# EAGLE schematic FlipDot (EAGLE 7.5.0)
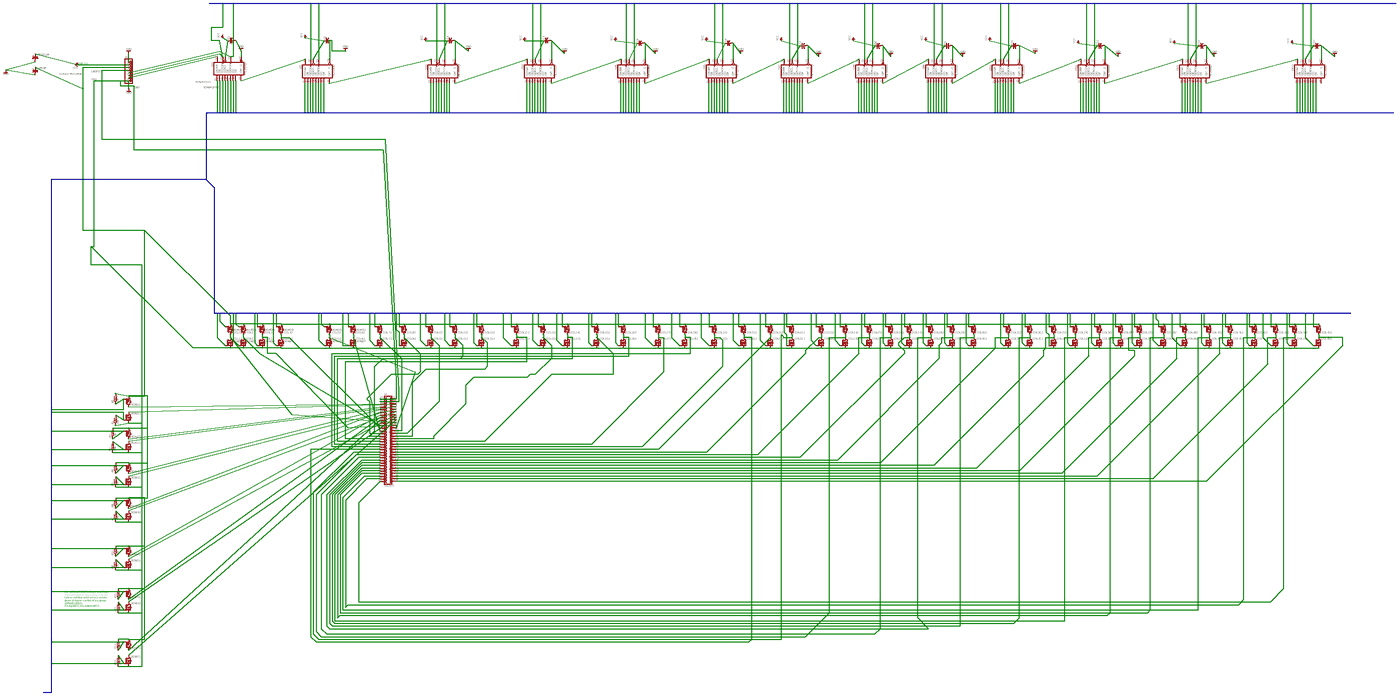
[diagram p0: schematic, sheet 1, overview]
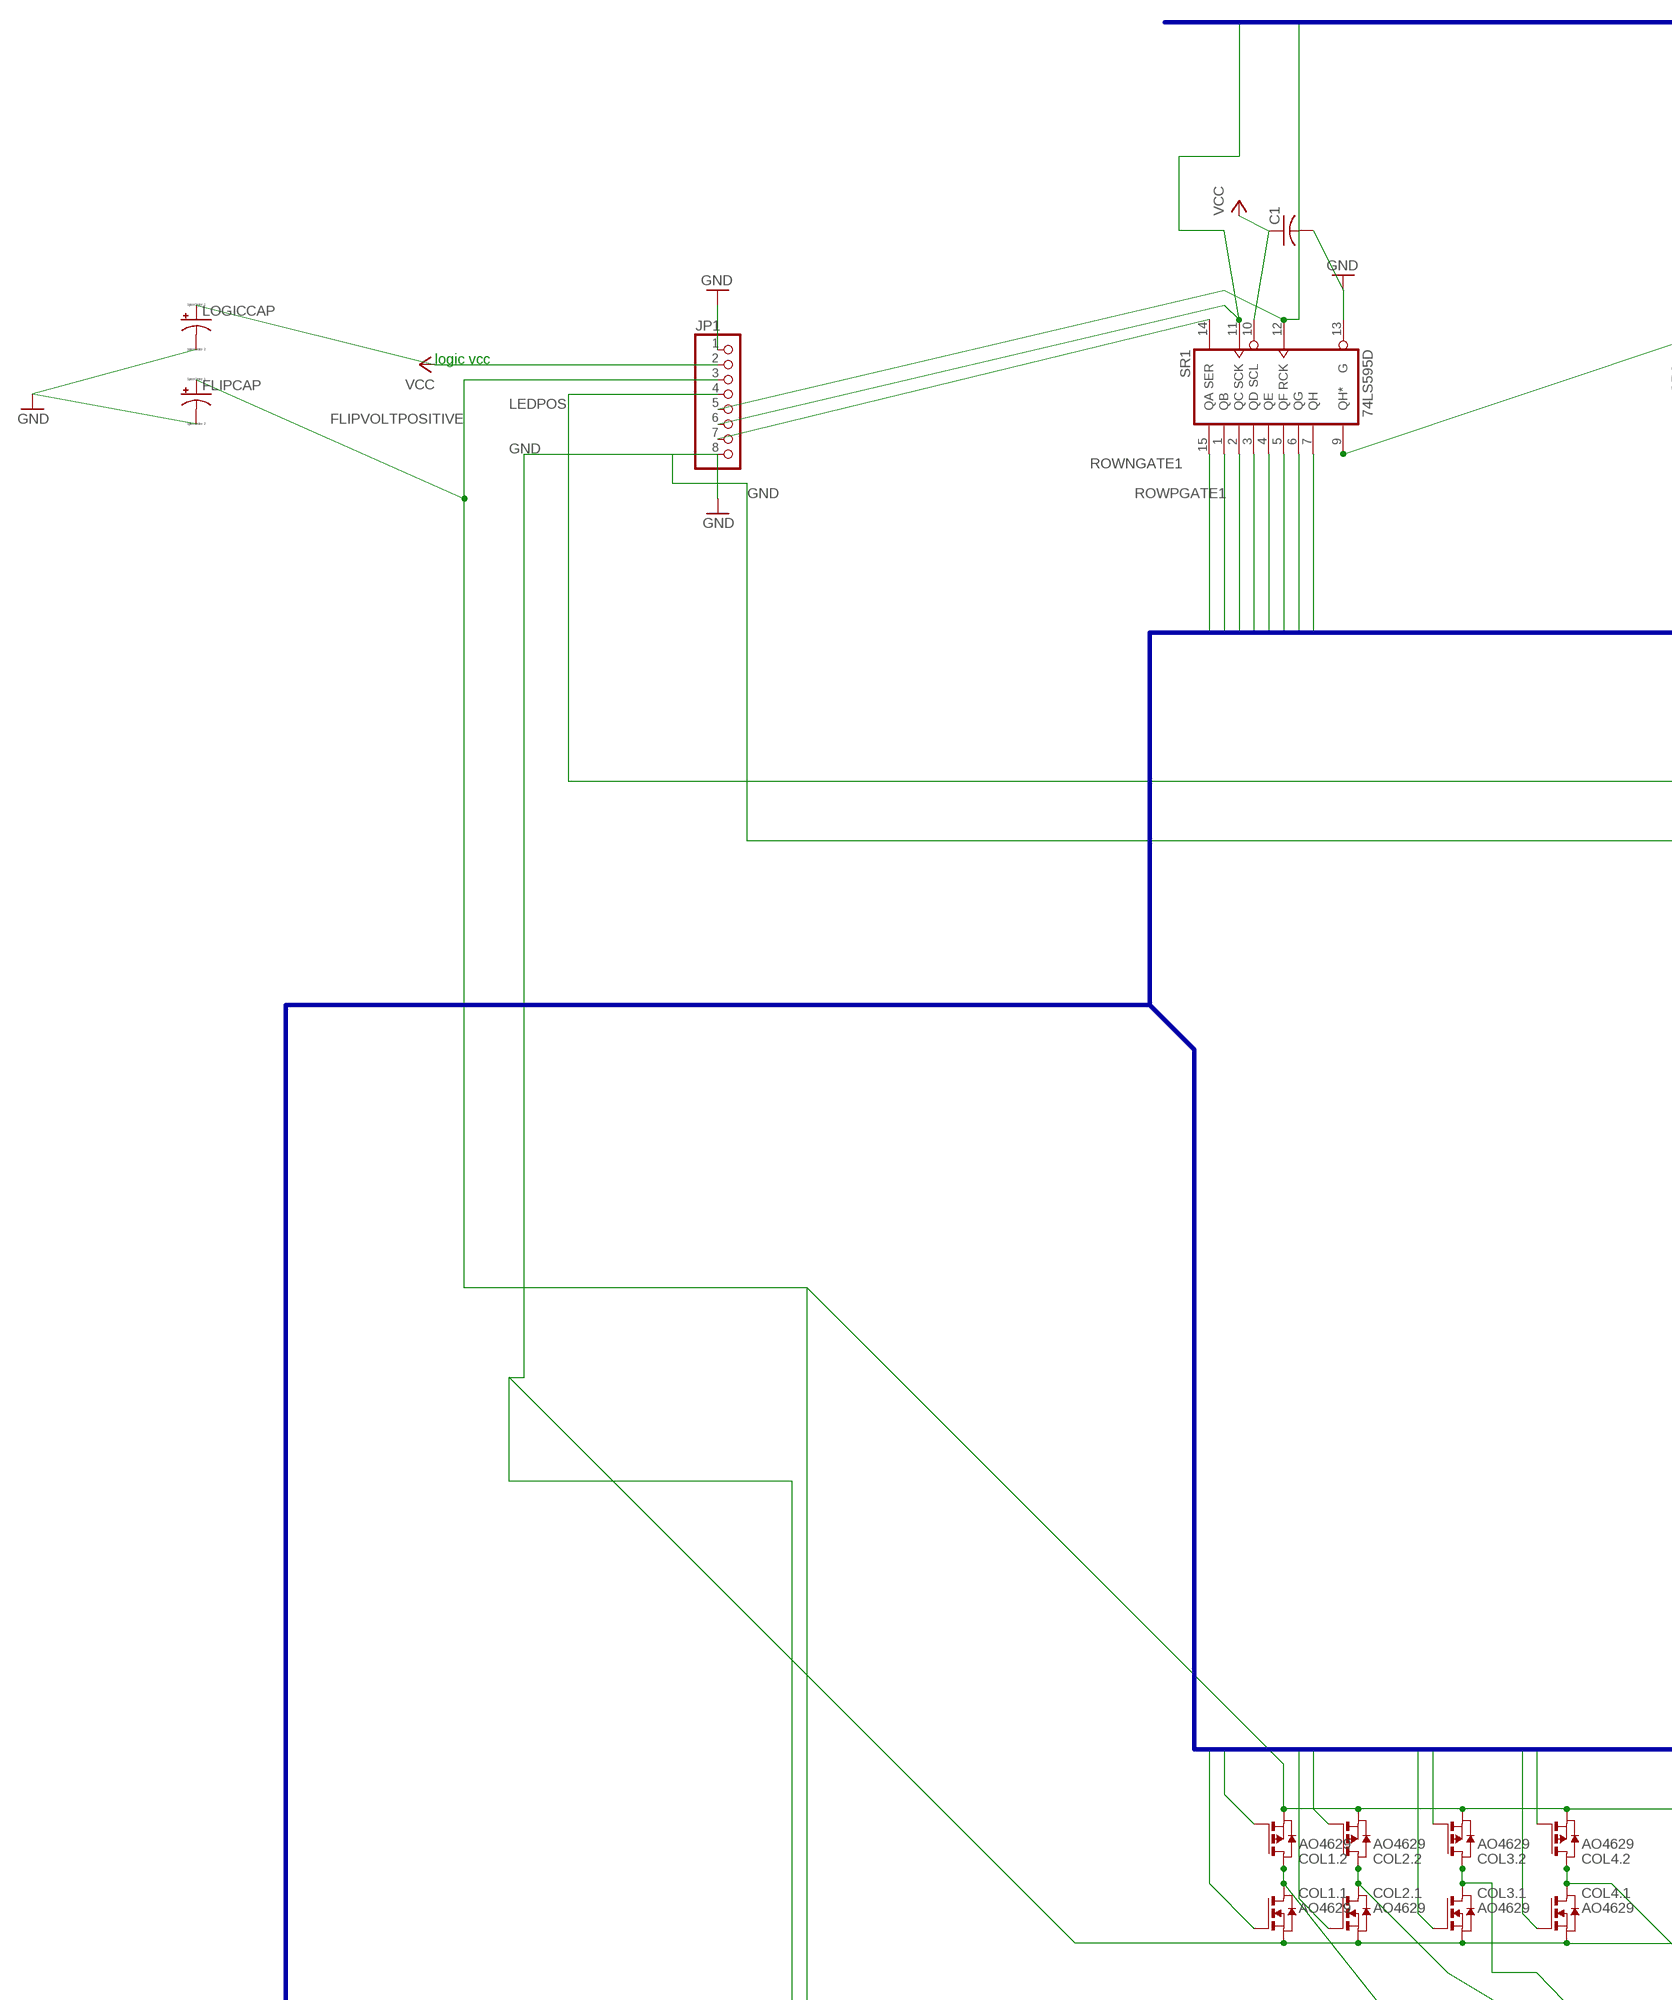
[diagram p1: schematic, sheet 1, part 1 of 8]
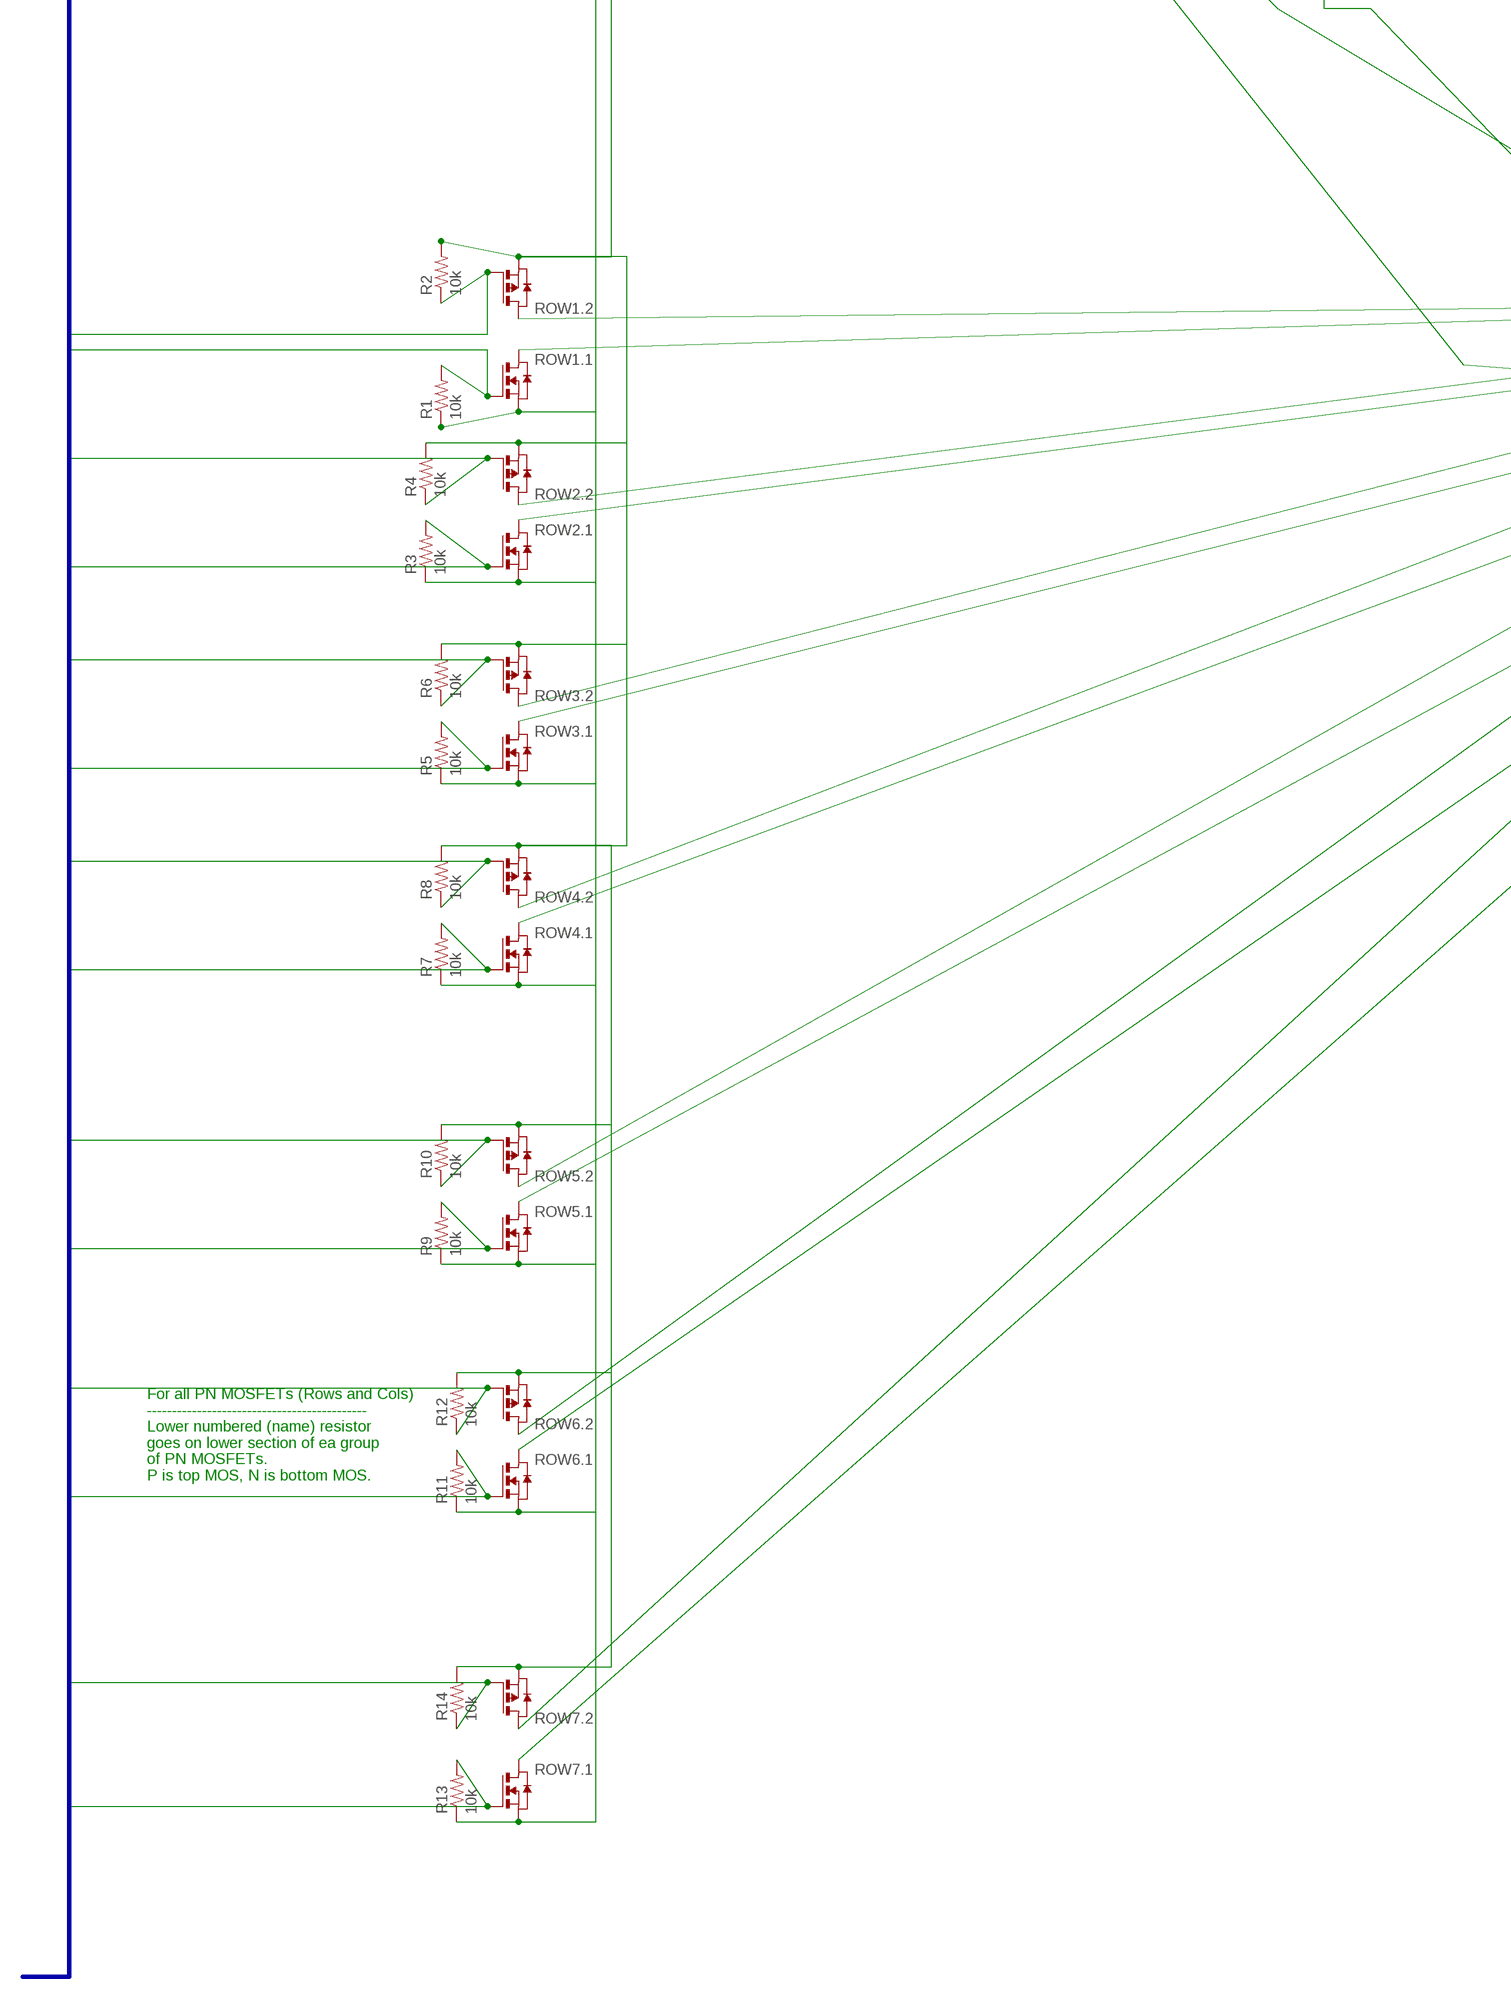
[diagram p2: schematic, sheet 1, part 2 of 8]
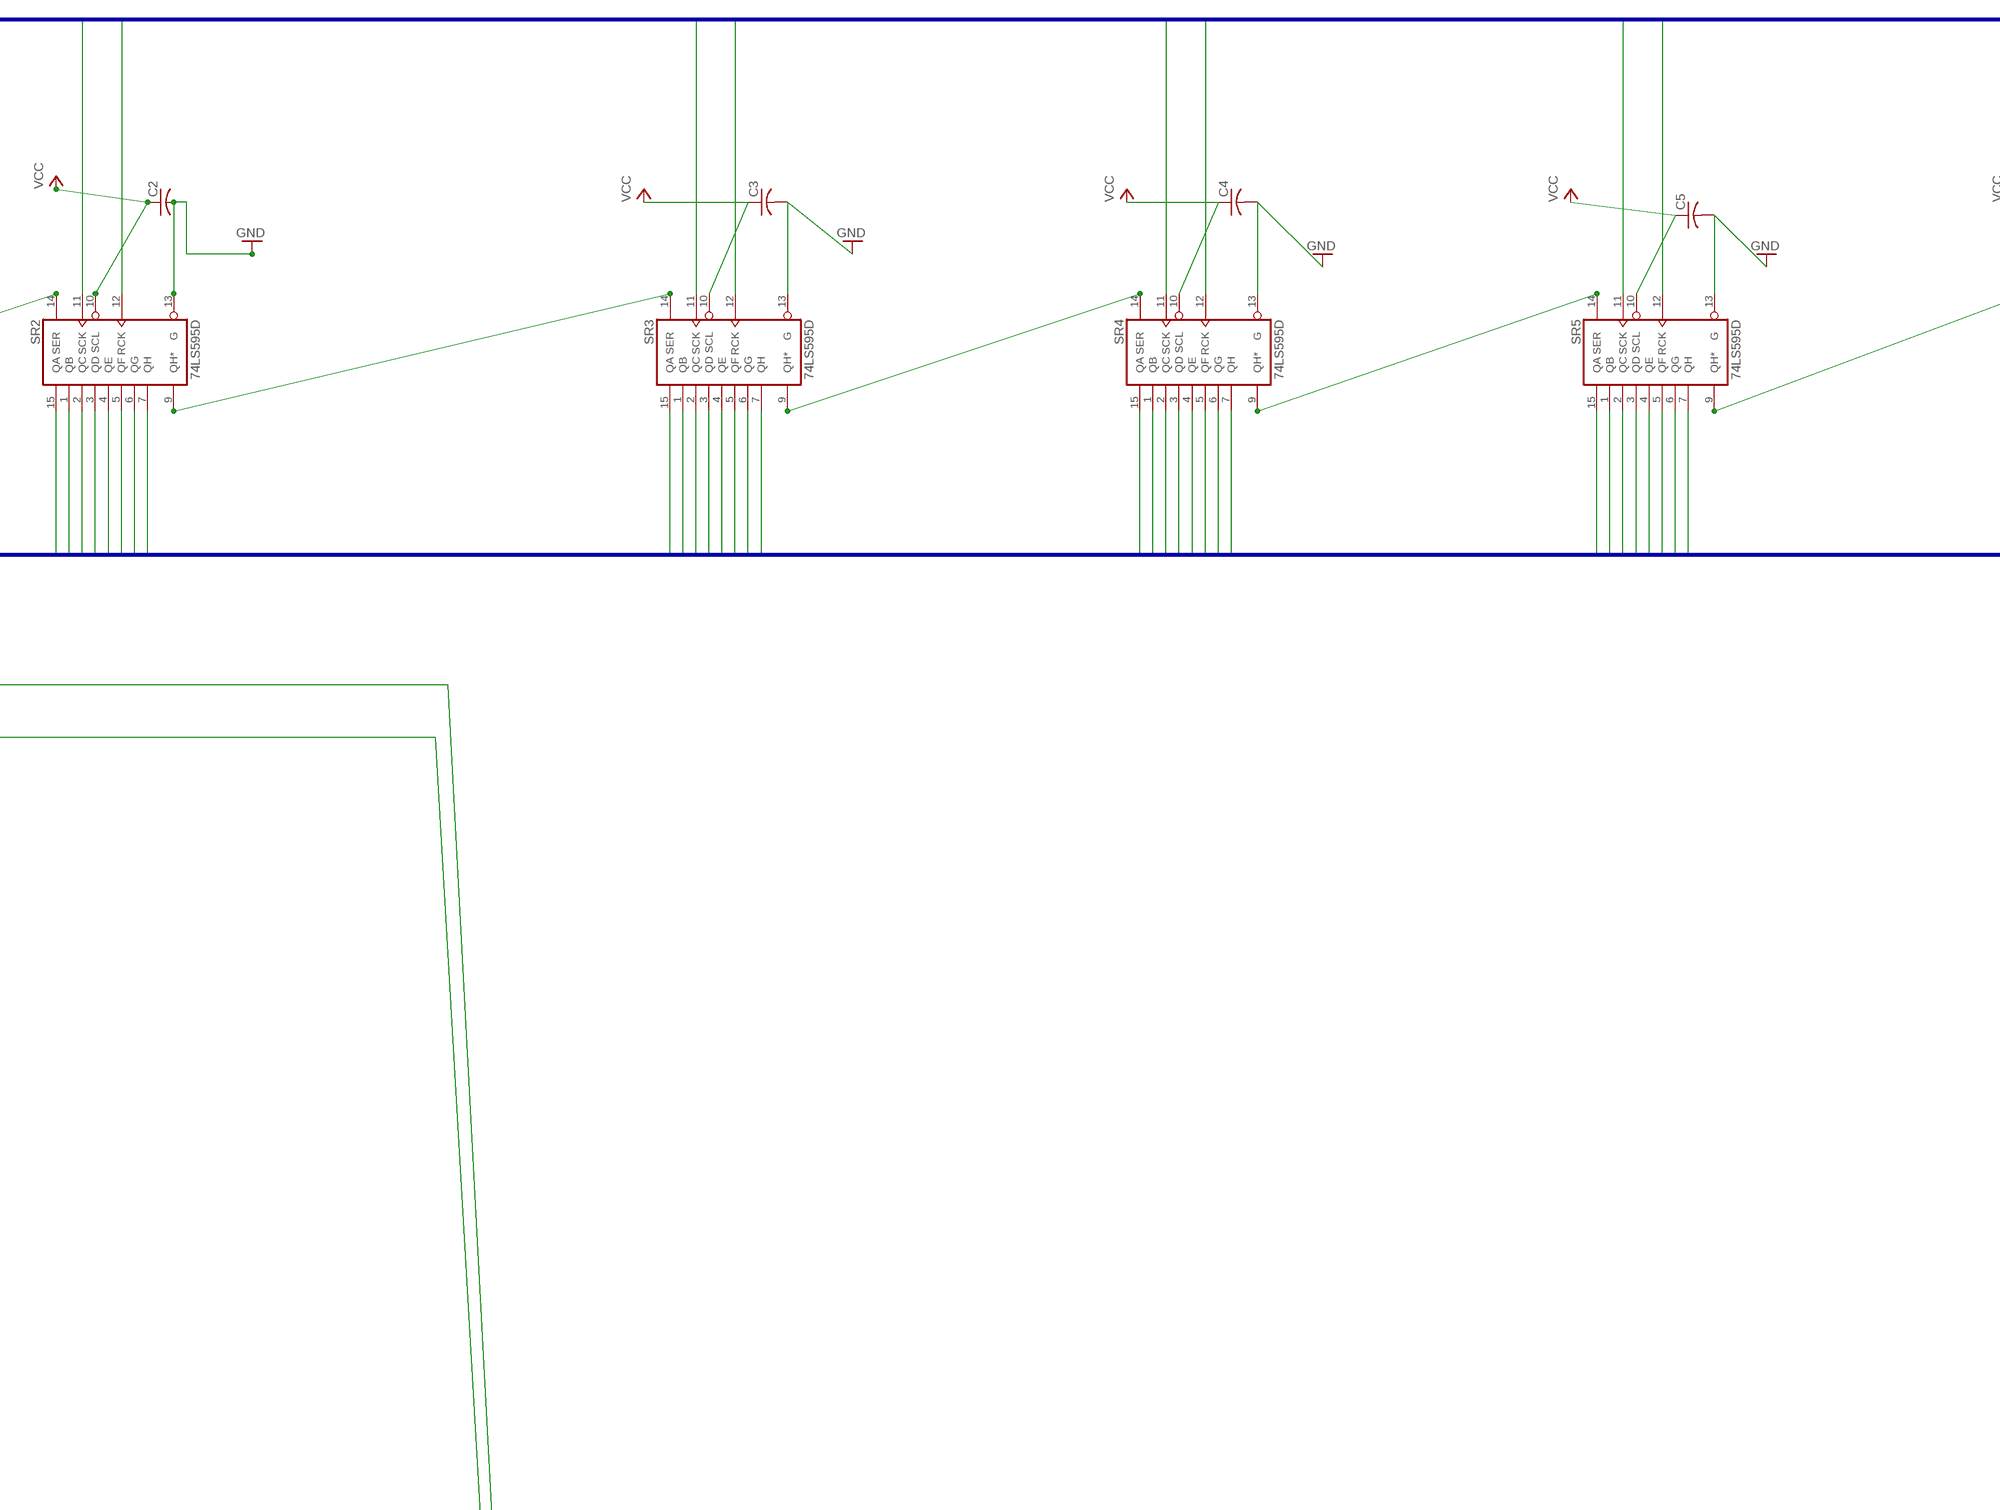
[diagram p3: schematic, sheet 1, part 3 of 8]
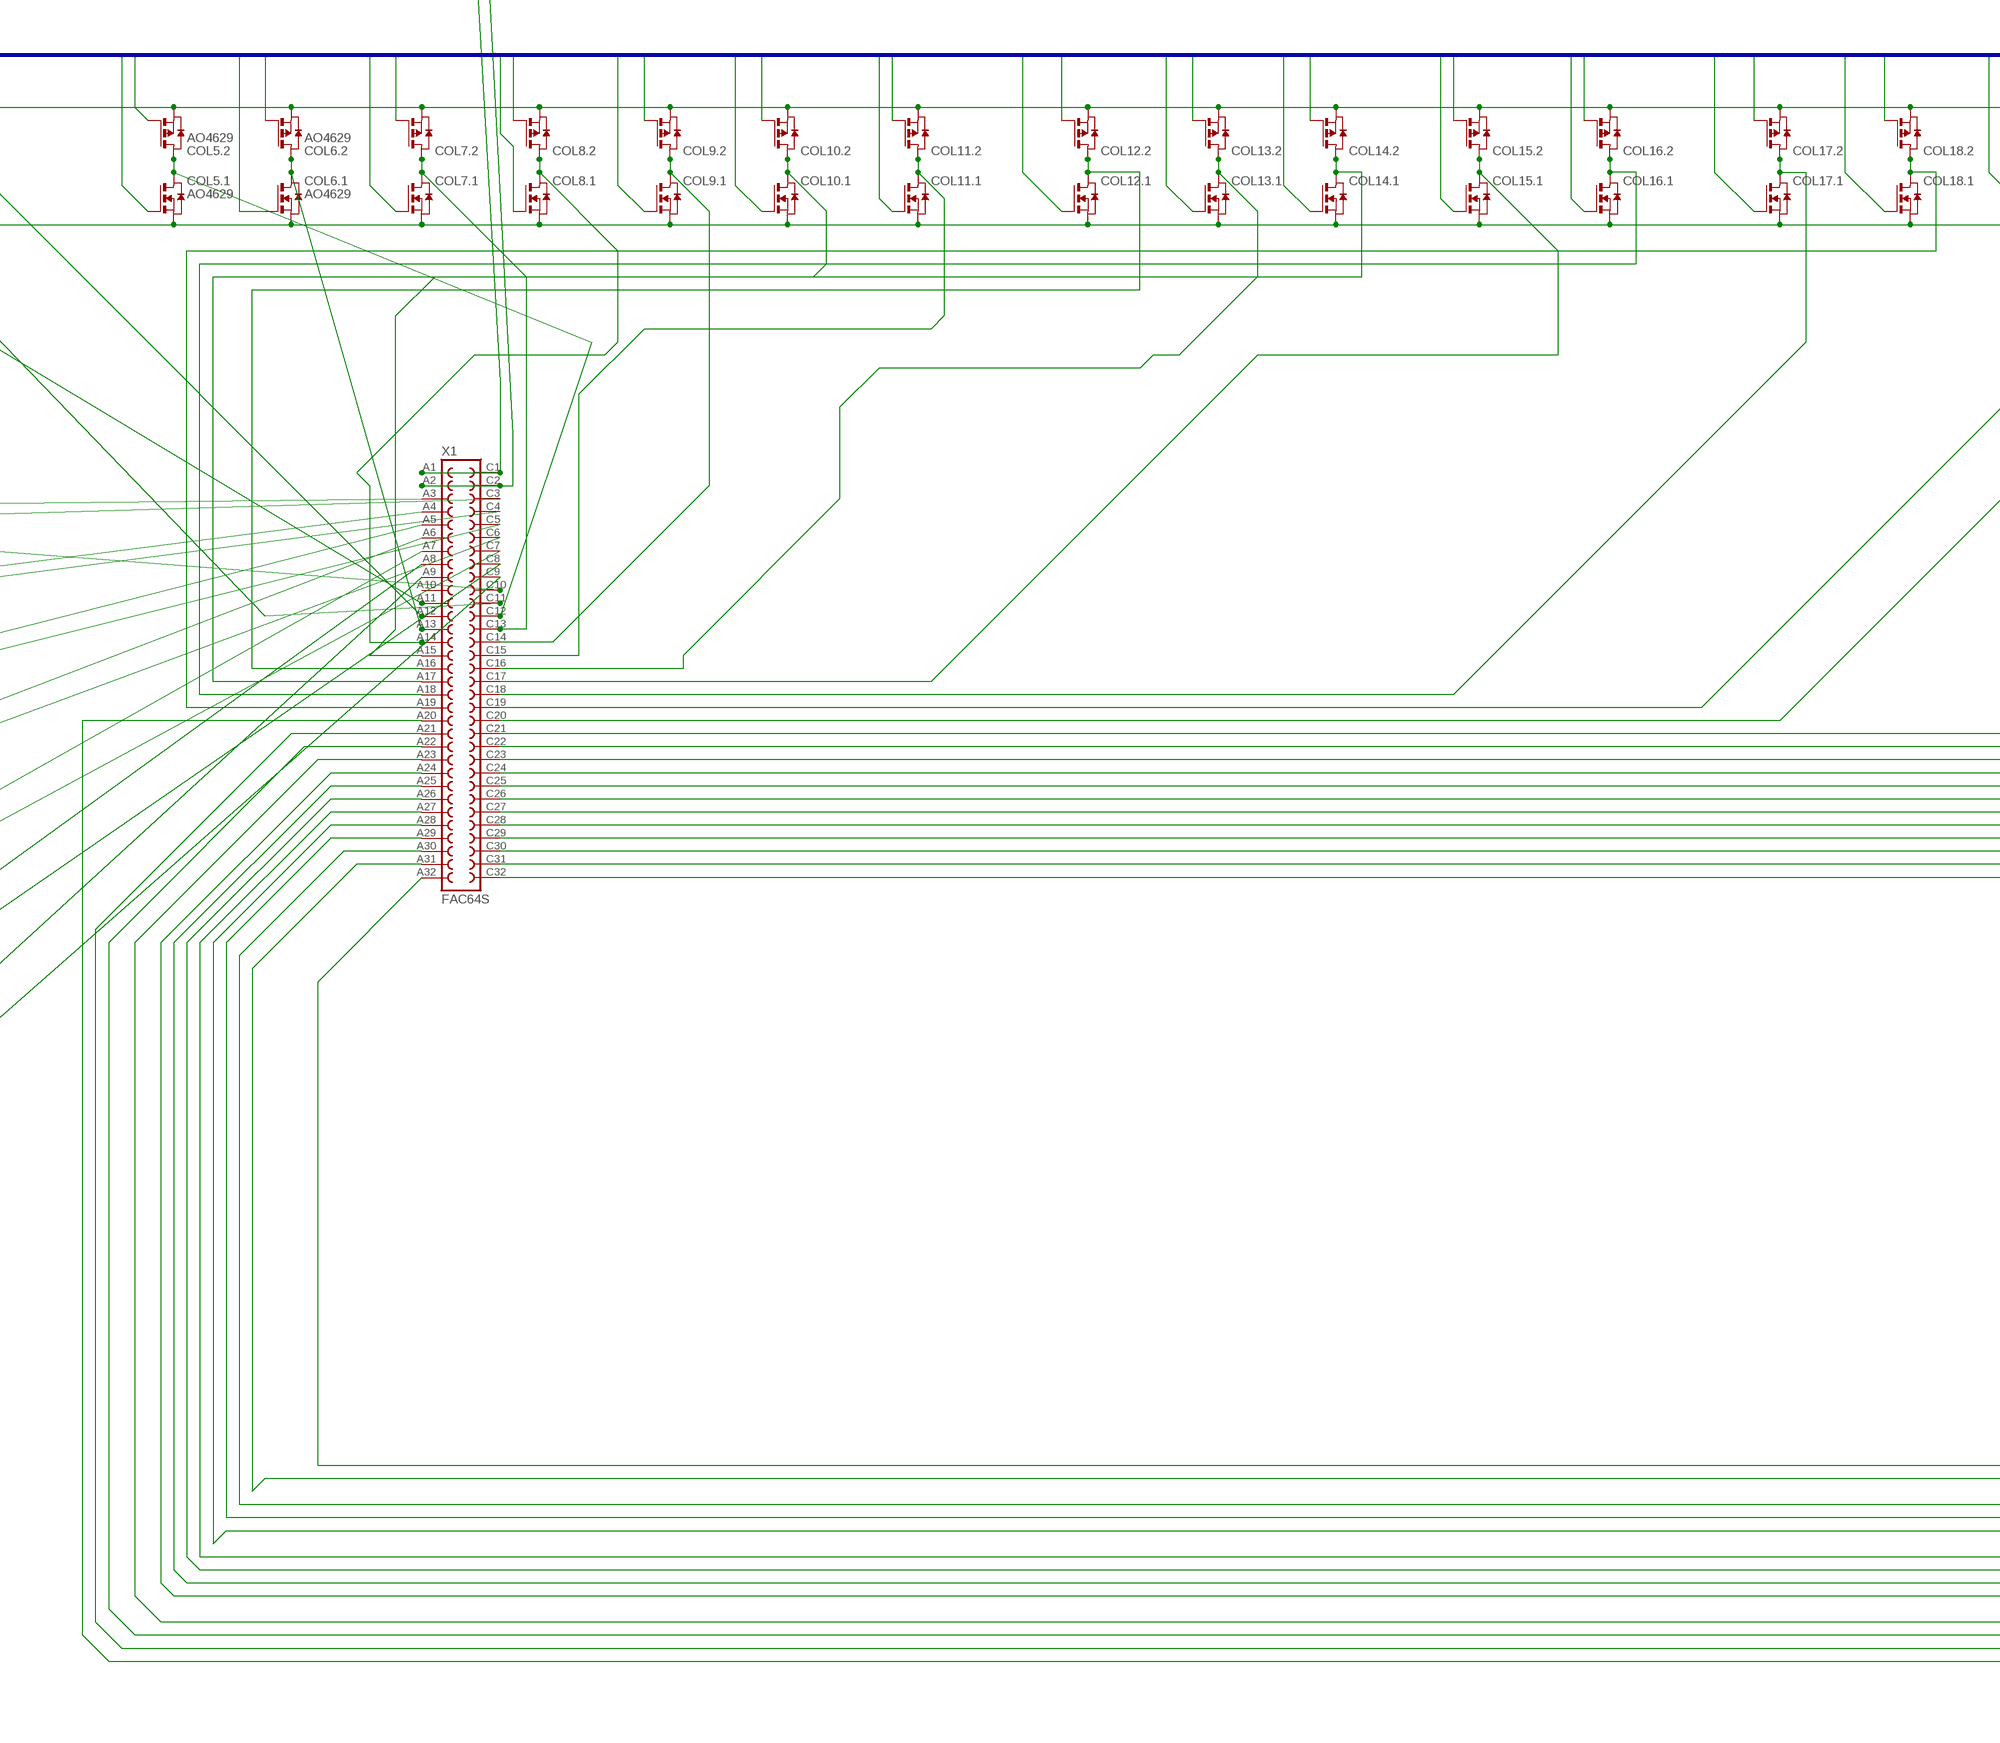
[diagram p4: schematic, sheet 1, part 4 of 8]
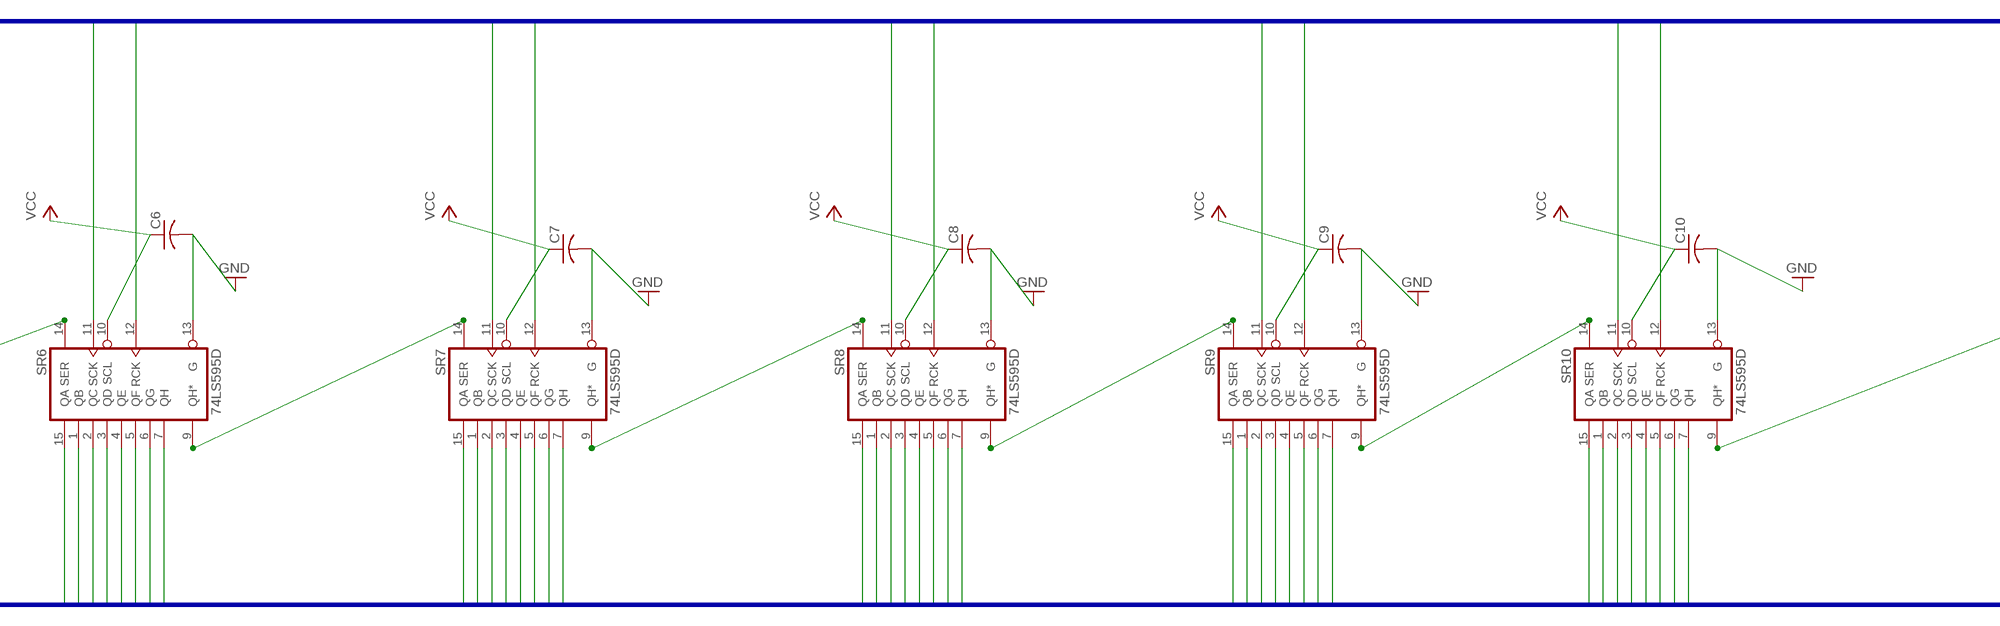
[diagram p5: schematic, sheet 1, part 5 of 8]
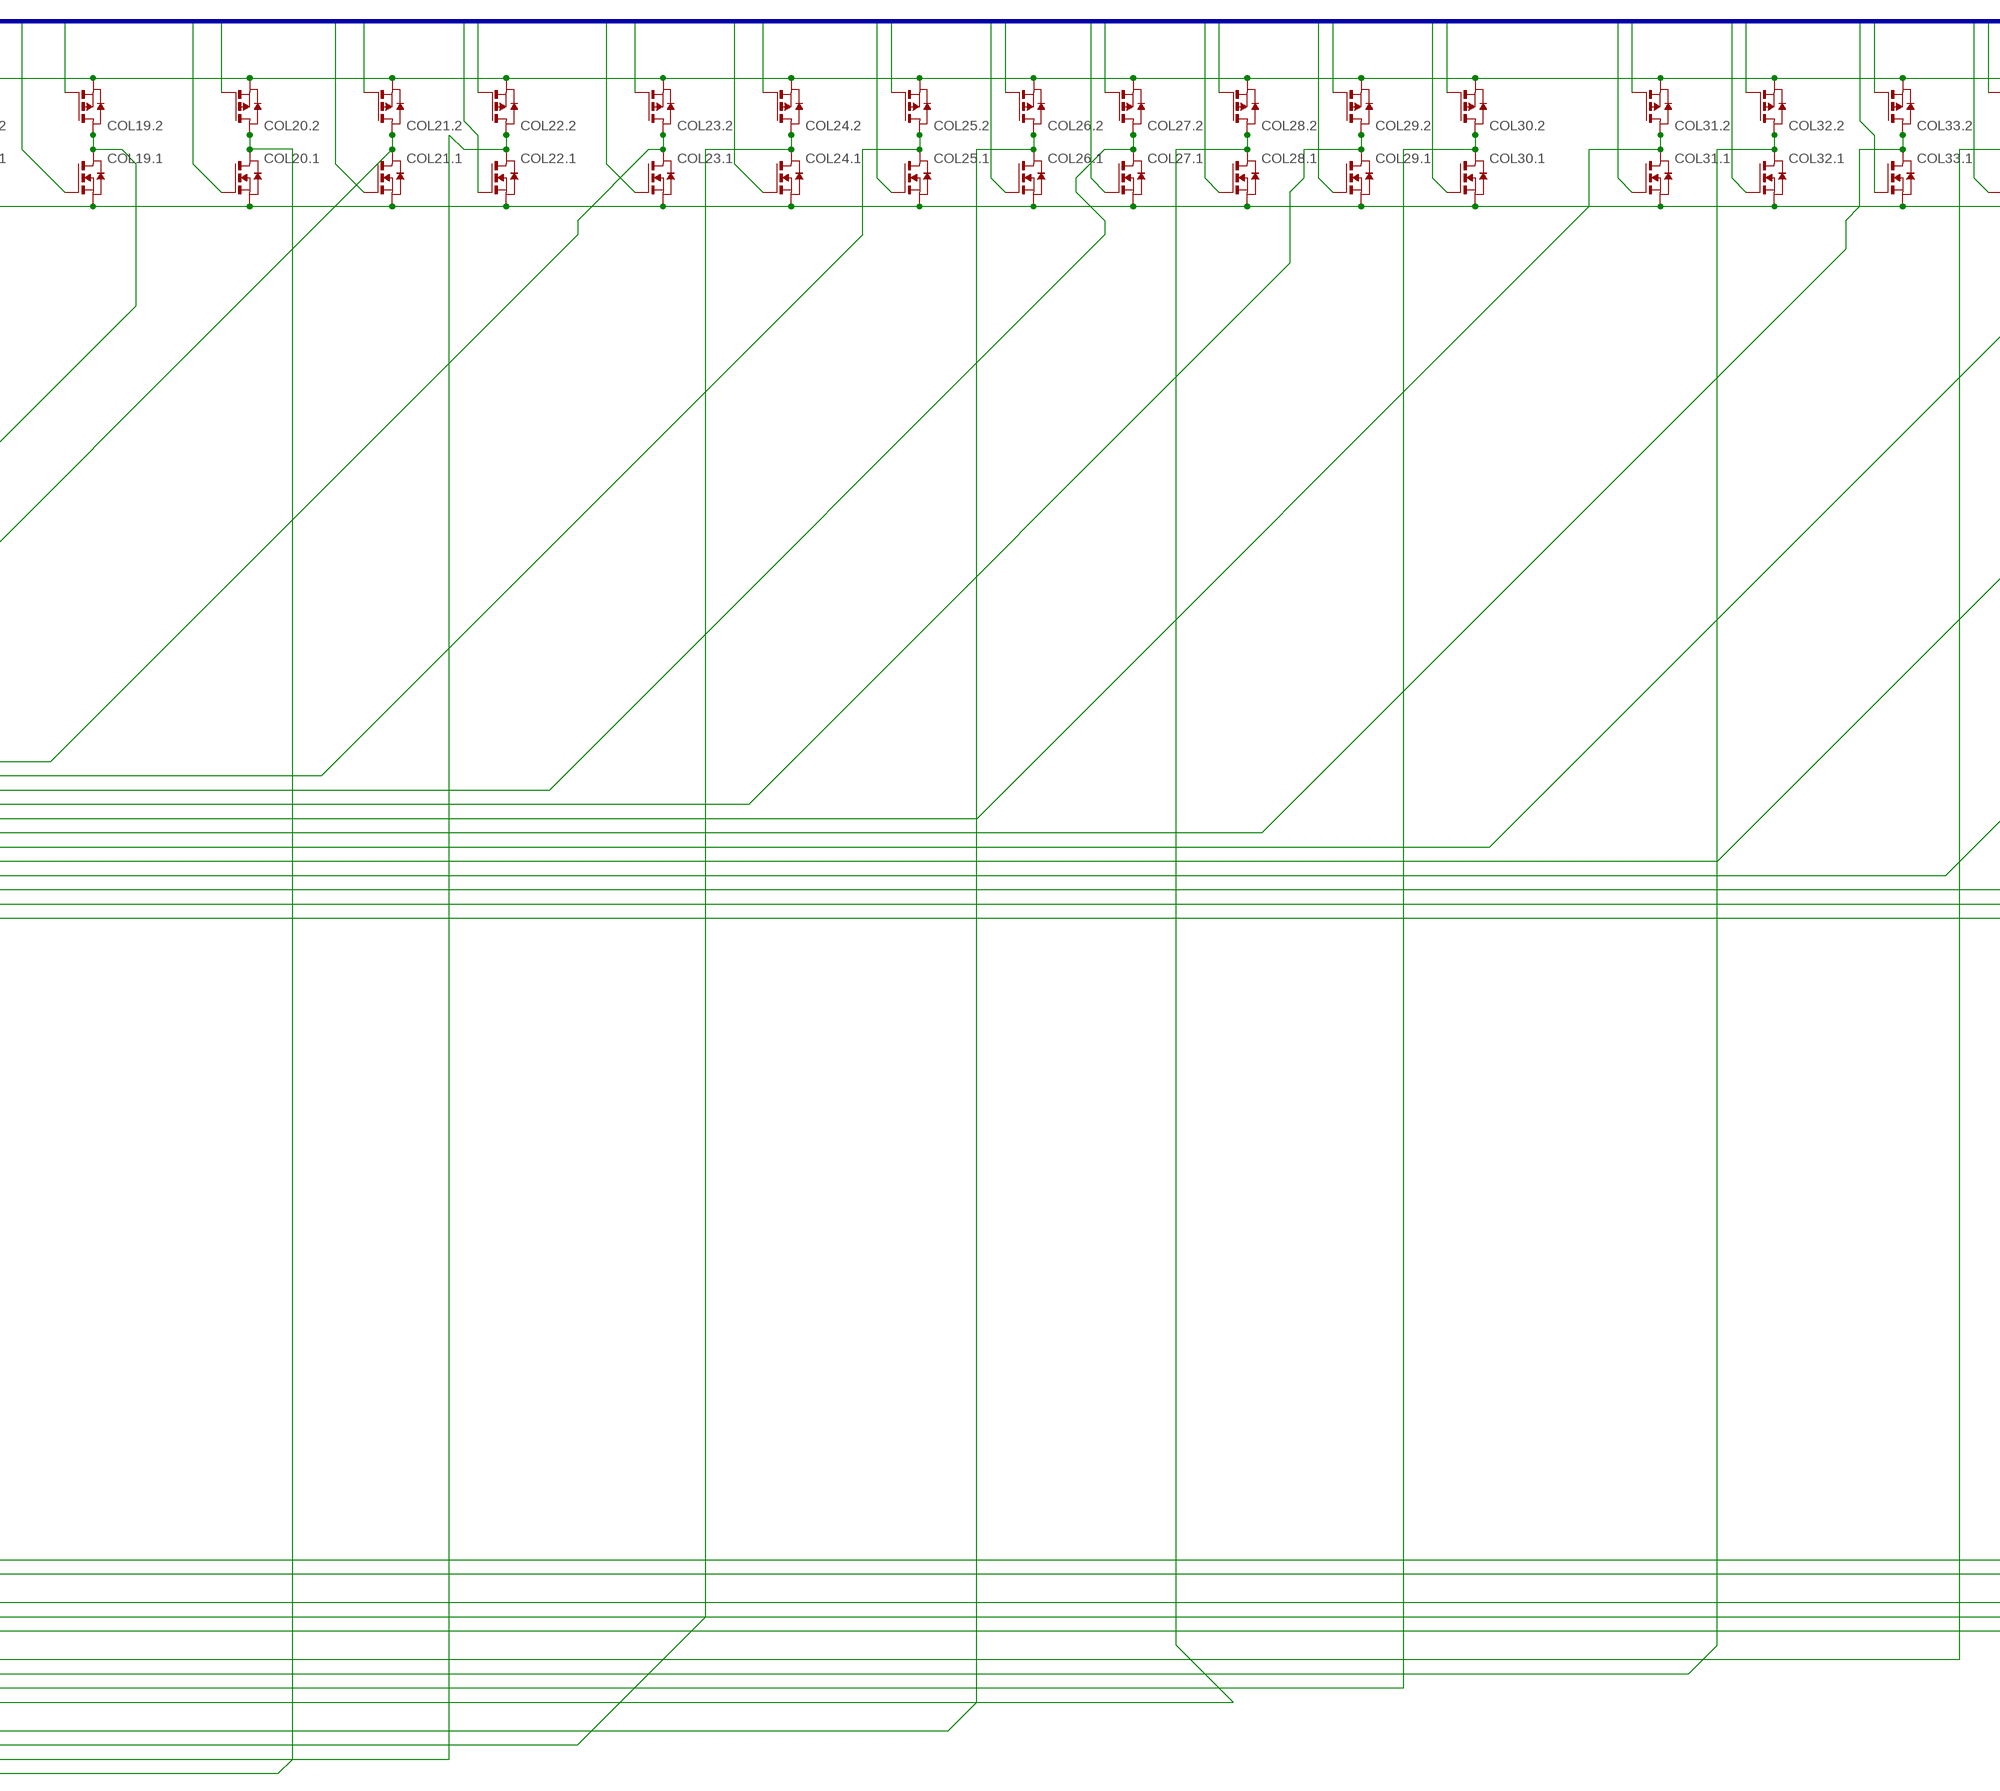
[diagram p6: schematic, sheet 1, part 6 of 8]
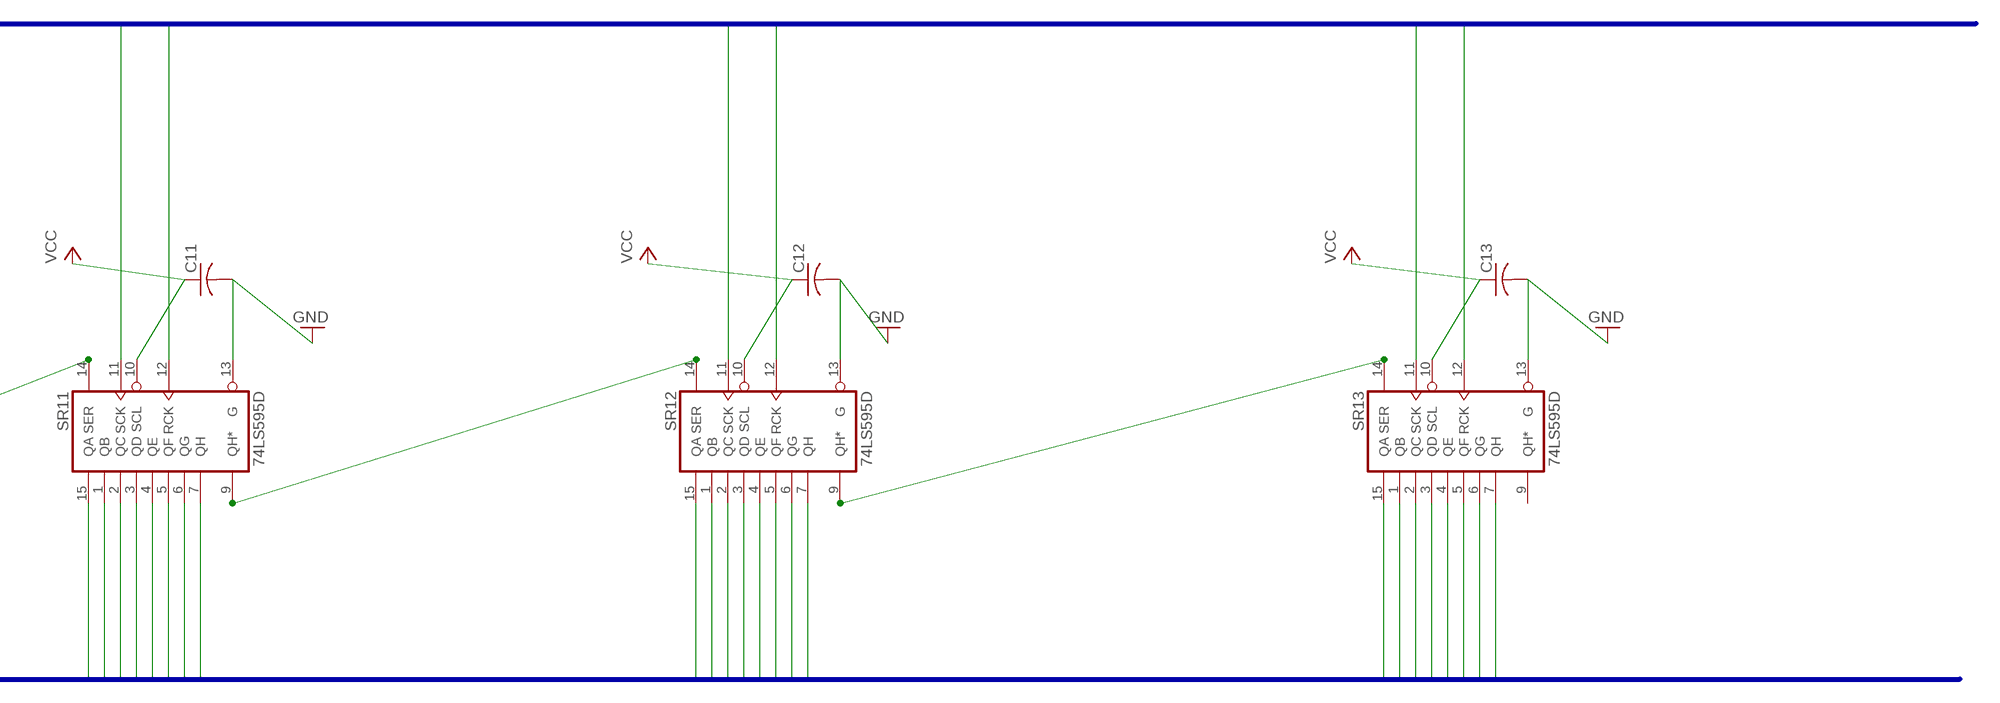
[diagram p7: schematic, sheet 1, part 7 of 8]
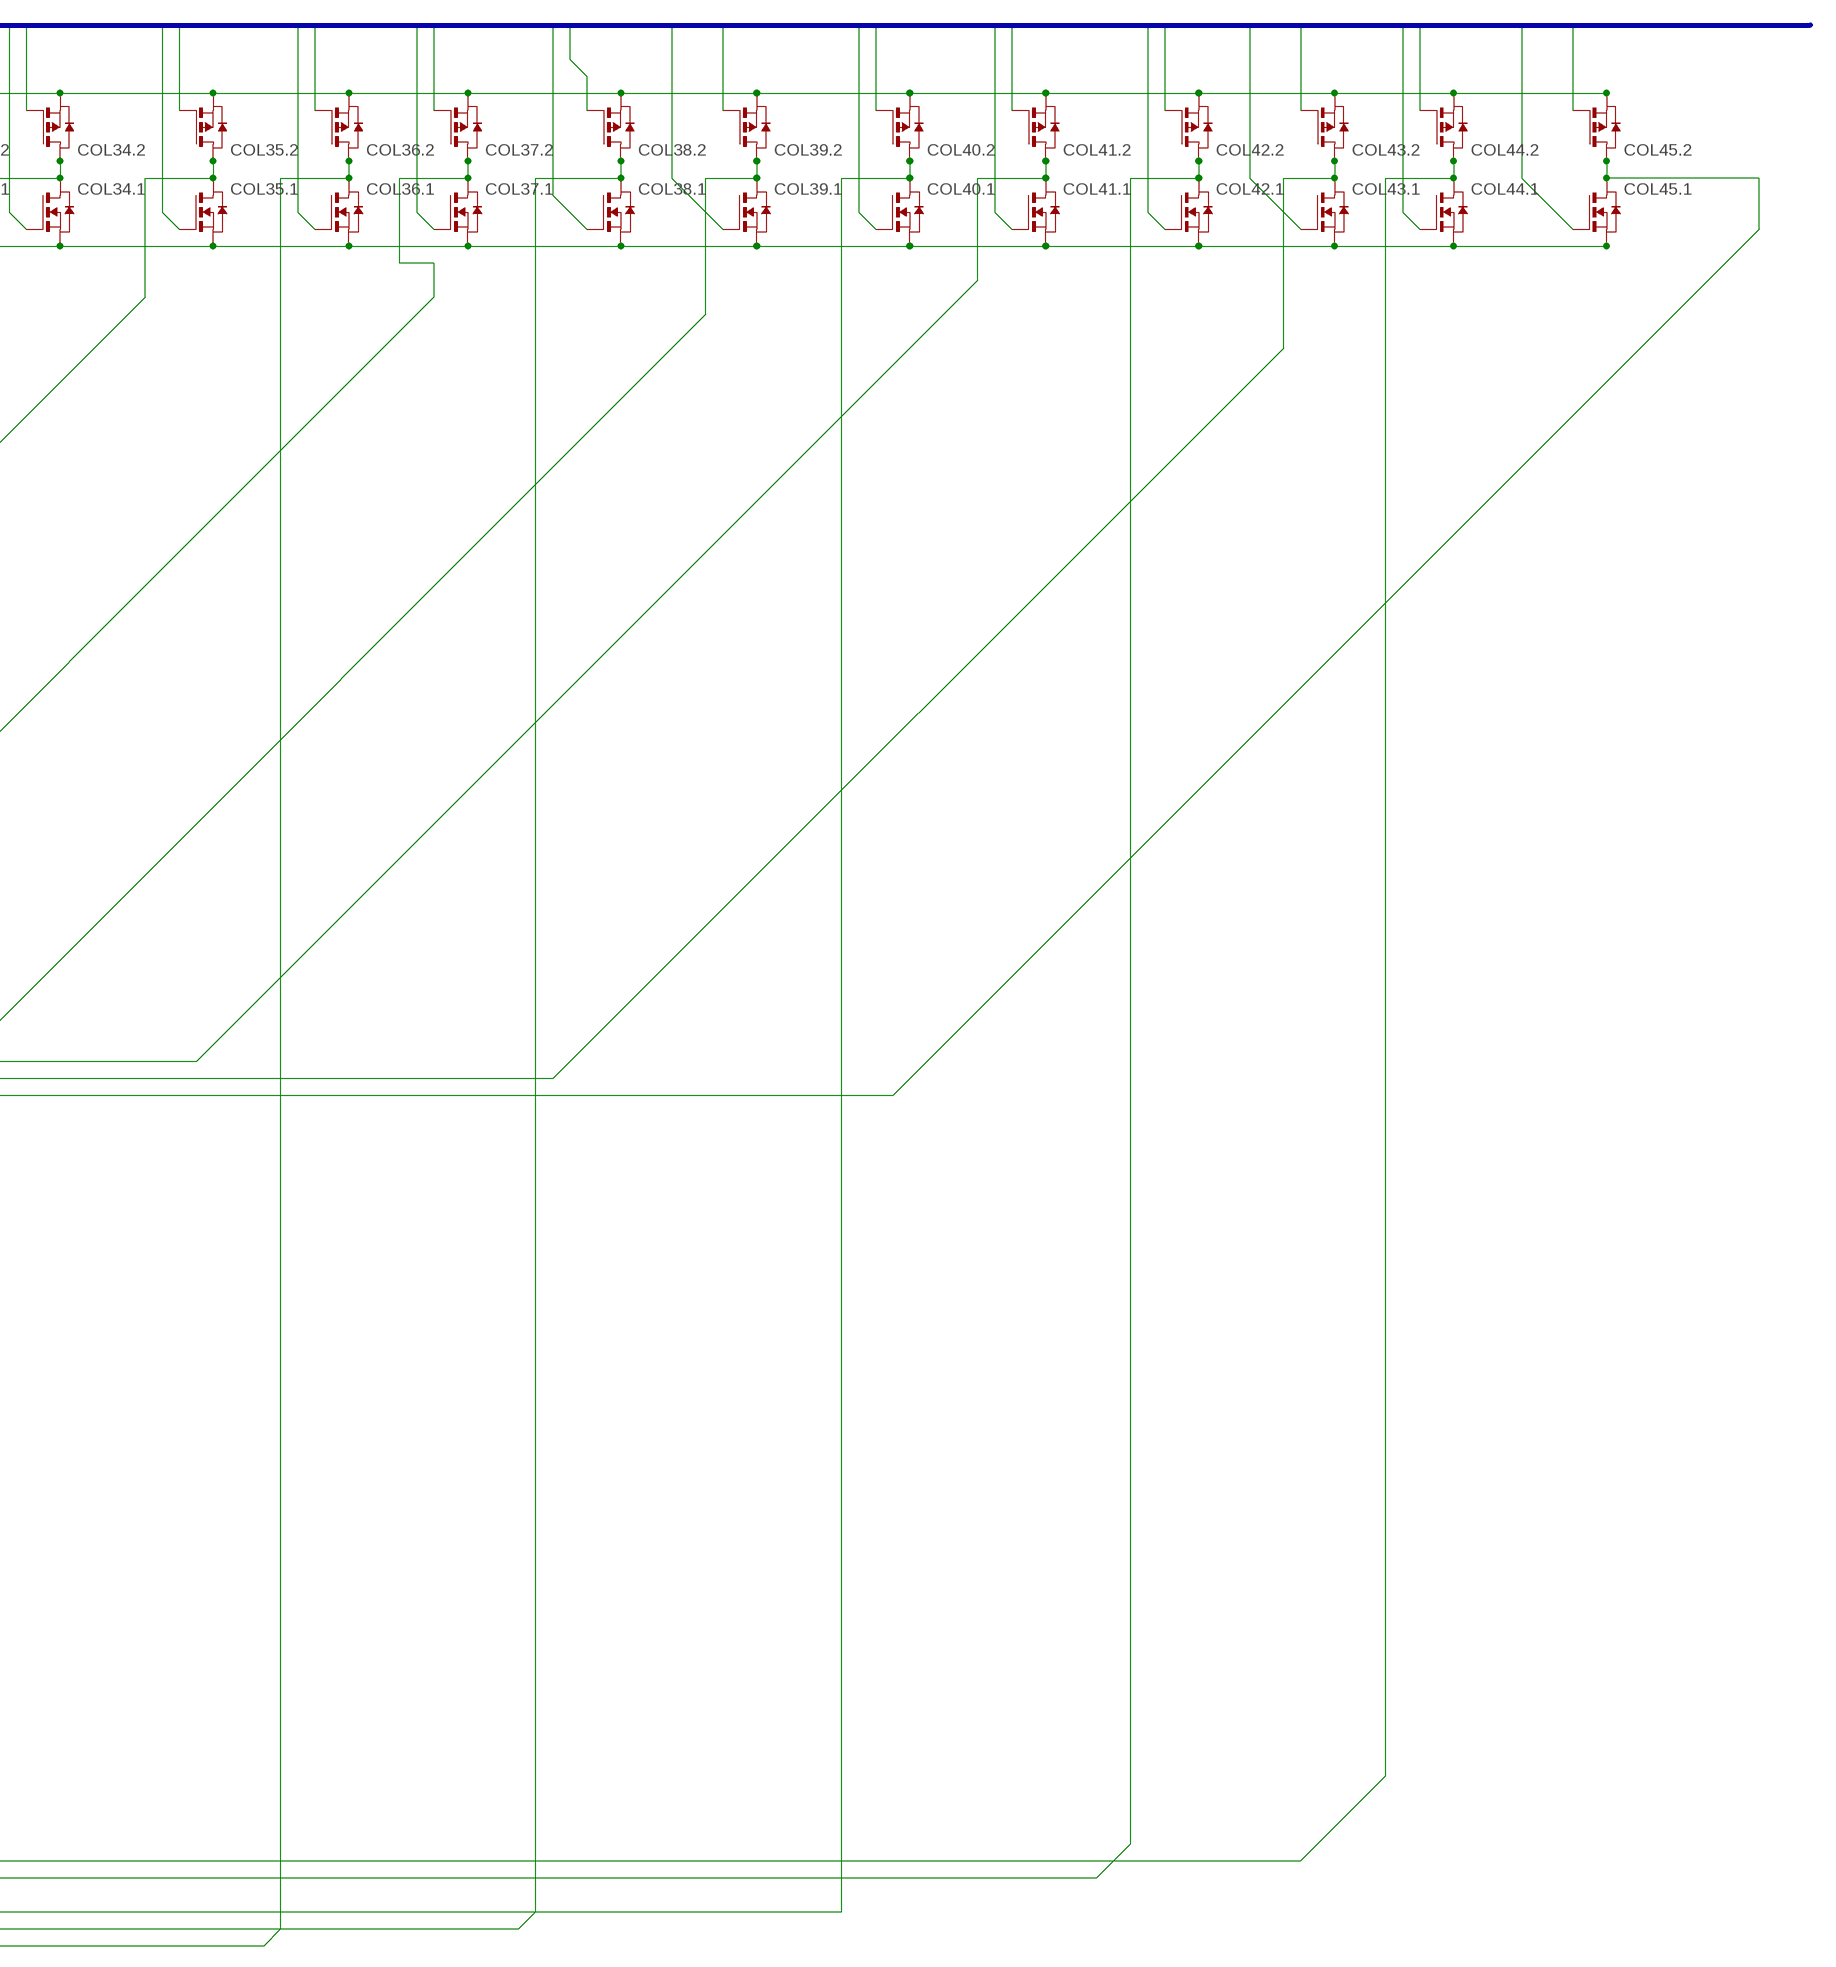
[diagram p8: schematic, sheet 1, part 8 of 8]

## Parts
C1  C-USC2012  [C2012]
C2  C-USC2012  [C2012]
C3  C-USC2012  [C2012]
C4  C-USC2012  [C2012]
C5  C-USC2012  [C2012]
C6  C-USC2012  [C2012]
C7  C-USC2012  [C2012]
C8  C-USC2012  [C2012]
C9  C-USC2012  [C2012]
C10  C-USC2012  [C2012]
C11  C-USC2012  [C2012]
C12  C-USC2012  [C2012]
C13  C-USC2012  [C2012]
COL1.  AO4629  PN_MOSFET-SO8  [SO8]
COL2.  AO4629  PN_MOSFET-SO8  [SO8]
COL3.  AO4629  PN_MOSFET-SO8  [SO8]
COL4.  AO4629  PN_MOSFET-SO8  [SO8]
COL5.  AO4629  PN_MOSFET-SO8  [SO8]
COL6.  AO4629  PN_MOSFET-SO8  [SO8]
COL7.  PN_MOSFET-SO8  [SO8]
COL8.  PN_MOSFET-SO8  [SO8]
COL9.  PN_MOSFET-SO8  [SO8]
COL10.  PN_MOSFET-SO8  [SO8]
COL11.  PN_MOSFET-SO8  [SO8]
COL12.  PN_MOSFET-SO8  [SO8]
COL13.  PN_MOSFET-SO8  [SO8]
COL14.  PN_MOSFET-SO8  [SO8]
COL15.  PN_MOSFET-SO8  [SO8]
COL16.  PN_MOSFET-SO8  [SO8]
COL17.  PN_MOSFET-SO8  [SO8]
COL18.  PN_MOSFET-SO8  [SO8]
COL19.  PN_MOSFET-SO8  [SO8]
COL20.  PN_MOSFET-SO8  [SO8]
COL21.  PN_MOSFET-SO8  [SO8]
COL22.  PN_MOSFET-SO8  [SO8]
COL23.  PN_MOSFET-SO8  [SO8]
COL24.  PN_MOSFET-SO8  [SO8]
COL25.  PN_MOSFET-SO8  [SO8]
COL26.  PN_MOSFET-SO8  [SO8]
COL27.  PN_MOSFET-SO8  [SO8]
COL28.  PN_MOSFET-SO8  [SO8]
COL29.  PN_MOSFET-SO8  [SO8]
COL30.  PN_MOSFET-SO8  [SO8]
COL31.  PN_MOSFET-SO8  [SO8]
COL32.  PN_MOSFET-SO8  [SO8]
COL33.  PN_MOSFET-SO8  [SO8]
COL34.  PN_MOSFET-SO8  [SO8]
COL35.  PN_MOSFET-SO8  [SO8]
COL36.  PN_MOSFET-SO8  [SO8]
COL37.  PN_MOSFET-SO8  [SO8]
COL38.  PN_MOSFET-SO8  [SO8]
COL39.  PN_MOSFET-SO8  [SO8]
COL40.  PN_MOSFET-SO8  [SO8]
COL41.  PN_MOSFET-SO8  [SO8]
COL42.  PN_MOSFET-SO8  [SO8]
COL43.  PN_MOSFET-SO8  [SO8]
COL44.  PN_MOSFET-SO8  [SO8]
COL45.  PN_MOSFET-SO8  [SO8]
FLIPCAP  CPOL-USE5-10.5  [E5-10,5]
JP1  PINHD-1X8  [1X08]
LOGICCAP  CPOL-USE5-10.5  [E5-10,5]
R1  10k  R-US_R2012  [R2012]
R2  10k  R-US_R2012  [R2012]
R3  10k  R-US_R2012  [R2012]
R4  10k  R-US_R2012  [R2012]
R5  10k  R-US_R2012  [R2012]
R6  10k  R-US_R2012  [R2012]
R7  10k  R-US_R2012  [R2012]
R8  10k  R-US_R2012  [R2012]
R9  10k  R-US_R2012  [R2012]
R10  10k  R-US_R2012  [R2012]
R11  10k  R-US_R2012  [R2012]
R12  10k  R-US_R2012  [R2012]
R13  10k  R-US_R2012  [R2012]
R14  10k  R-US_R2012  [R2012]
ROW1.  PN_MOSFET-SO8  [SO8]
ROW2.  PN_MOSFET-SO8  [SO8]
ROW3.  PN_MOSFET-SO8  [SO8]
ROW4.  PN_MOSFET-SO8  [SO8]
ROW5.  PN_MOSFET-SO8  [SO8]
ROW6.  PN_MOSFET-SO8  [SO8]
ROW7.  PN_MOSFET-SO8  [SO8]
SR1  74LS595D  [SO16]
SR2  74LS595D  [SO16]
SR3  74LS595D  [SO16]
SR4  74LS595D  [SO16]
SR5  74LS595D  [SO16]
SR6  74LS595D  [SO16]
SR7  74LS595D  [SO16]
SR8  74LS595D  [SO16]
SR9  74LS595D  [SO16]
SR10  74LS595D  [SO16]
SR11  74LS595D  [SO16]
SR12  74LS595D  [SO16]
SR13  74LS595D  [SO16]
X1  FAC64S  [FAC64S]

## Nets
COL1COMMON [fetcommons]: COL1..5(2:D) COL1..6(2:D) COL1..7(1:D) COL1..8(1:D) X1.C10
COL2COMMON [fetcommons]: COL2..5(2:D) COL2..6(2:D) COL2..7(1:D) COL2..8(1:D) X1.A11
COL3COMMON [fetcommons]: COL3..5(2:D) COL3..6(2:D) COL3..7(1:D) COL3..8(1:D) X1.C11
COL4COMMON [fetcommons]: COL4..5(2:D) COL4..6(2:D) COL4..7(1:D) COL4..8(1:D) X1.A12
COL5COMMON [fetcommons]: COL5..5(2:D) COL5..6(2:D) COL5..7(1:D) COL5..8(1:D) X1.C12
COL6COMMON [fetcommons]: COL6..5(2:D) COL6..6(2:D) COL6..7(1:D) COL6..8(1:D) X1.A13
COL7COMMON [fetcommons]: COL7..5(2:D) COL7..6(2:D) COL7..7(1:D) COL7..8(1:D) X1.C13
COL8COMMON [fetcommons]: COL8..5(2:D) COL8..6(2:D) COL8..7(1:D) COL8..8(1:D) X1.A14
COL9COMMON [fetcommons]: COL9..5(2:D) COL9..6(2:D) COL9..7(1:D) COL9..8(1:D) X1.C14
COL10COMMON [fetcommons]: COL10..5(2:D) COL10..6(2:D) COL10..7(1:D) COL10..8(1:D) X1.A15
COL11COMMON [fetcommons]: COL11..5(2:D) COL11..6(2:D) COL11..7(1:D) COL11..8(1:D) X1.C15
COL12COMMON [fetcommons]: COL12..5(2:D) COL12..6(2:D) COL12..7(1:D) COL12..8(1:D) X1.A16
COL13COMMON [fetcommons]: COL13..5(2:D) COL13..6(2:D) COL13..7(1:D) COL13..8(1:D) X1.C16
COL14COMMON [fetcommons]: COL14..5(2:D) COL14..6(2:D) COL14..7(1:D) COL14..8(1:D) X1.A17
COL15COMMON [fetcommons]: COL15..5(2:D) COL15..6(2:D) COL15..7(1:D) COL15..8(1:D) X1.C17
COL16COMMON [fetcommons]: COL16..5(2:D) COL16..6(2:D) COL16..7(1:D) COL16..8(1:D) X1.A18
COL17COMMON [fetcommons]: COL17..5(2:D) COL17..6(2:D) COL17..7(1:D) COL17..8(1:D) X1.C18
COL18COMMON [fetcommons]: COL18..5(2:D) COL18..6(2:D) COL18..7(1:D) COL18..8(1:D) X1.A19
COL19COMMON [fetcommons]: COL19..5(2:D) COL19..6(2:D) COL19..7(1:D) COL19..8(1:D) X1.C19
COL20COMMON [fetcommons]: COL20..5(2:D) COL20..6(2:D) COL20..7(1:D) COL20..8(1:D) X1.A20
COL21COMMON [fetcommons]: COL21..5(2:D) COL21..6(2:D) COL21..7(1:D) COL21..8(1:D) X1.C20
COL22COMMON [fetcommons]: COL22..5(2:D) COL22..6(2:D) COL22..7(1:D) COL22..8(1:D) X1.A21
COL23COMMON [fetcommons]: COL23..5(2:D) COL23..6(2:D) COL23..7(1:D) COL23..8(1:D) X1.C21
COL24COMMON [fetcommons]: COL24..5(2:D) COL24..6(2:D) COL24..7(1:D) COL24..8(1:D) X1.A22
COL25COMMON [fetcommons]: COL25..5(2:D) COL25..6(2:D) COL25..7(1:D) COL25..8(1:D) X1.C22
COL26COMMON [fetcommons]: COL26..5(2:D) COL26..6(2:D) COL26..7(1:D) COL26..8(1:D) X1.A23
COL27COMMON [fetcommons]: COL27..5(2:D) COL27..6(2:D) COL27..7(1:D) COL27..8(1:D) X1.C23
COL28COMMON [fetcommons]: COL28..5(2:D) COL28..6(2:D) COL28..7(1:D) COL28..8(1:D) X1.A24
COL29COMMON [fetcommons]: COL29..5(2:D) COL29..6(2:D) COL29..7(1:D) COL29..8(1:D) X1.C24
COL30COMMON [fetcommons]: COL30..5(2:D) COL30..6(2:D) COL30..7(1:D) COL30..8(1:D) X1.A25
COL31COMMON [fetcommons]: COL31..5(2:D) COL31..6(2:D) COL31..7(1:D) COL31..8(1:D) X1.C25
COL32COMMON [fetcommons]: COL32..5(2:D) COL32..6(2:D) COL32..7(1:D) COL32..8(1:D) X1.A26
COL33COMMON [fetcommons]: COL33..5(2:D) COL33..6(2:D) COL33..7(1:D) COL33..8(1:D) X1.C26
COL34COMMON [fetcommons]: COL34..5(2:D) COL34..6(2:D) COL34..7(1:D) COL34..8(1:D) X1.A27
COL35COMMON [fetcommons]: COL35..5(2:D) COL35..6(2:D) COL35..7(1:D) COL35..8(1:D) X1.C27
COL36COMMON [fetcommons]: COL36..5(2:D) COL36..6(2:D) COL36..7(1:D) COL36..8(1:D) X1.A28
COL37COMMON [fetcommons]: COL37..5(2:D) COL37..6(2:D) COL37..7(1:D) COL37..8(1:D) X1.C28
COL38COMMON [fetcommons]: COL38..5(2:D) COL38..6(2:D) COL38..7(1:D) COL38..8(1:D) X1.A29
COL39COMMON [fetcommons]: COL39..5(2:D) COL39..6(2:D) COL39..7(1:D) COL39..8(1:D) X1.C29
COL40COMMON [fetcommons]: COL40..5(2:D) COL40..6(2:D) COL40..7(1:D) COL40..8(1:D) X1.A30
COL41COMMON [fetcommons]: COL41..5(2:D) COL41..6(2:D) COL41..7(1:D) COL41..8(1:D) X1.C30
COL42COMMON [fetcommons]: COL42..5(2:D) COL42..6(2:D) COL42..7(1:D) COL42..8(1:D) X1.A31
COL43COMMON [fetcommons]: COL43..5(2:D) COL43..6(2:D) COL43..7(1:D) COL43..8(1:D) X1.C31
COL44COMMON [fetcommons]: COL44..5(2:D) COL44..6(2:D) COL44..7(1:D) COL44..8(1:D) X1.A32
COL45COMMON [fetcommons]: COL45..5(2:D) COL45..6(2:D) COL45..7(1:D) COL45..8(1:D) X1.C32
COLNGATE1: COL1..2(1:G) SR2.6(QG)
COLNGATE2: COL2..2(1:G) SR3.15(QA)
COLNGATE3: COL3..2(1:G) SR3.2(QC)
COLNGATE4: COL4..2(1:G) SR3.4(QE)
COLNGATE5: COL5..2(1:G) SR3.6(QG)
COLNGATE6: COL6..2(1:G) SR4.15(QA)
COLNGATE7: COL7..2(1:G) SR4.2(QC)
COLNGATE8: COL8..2(1:G) SR4.4(QE)
COLNGATE9: COL9..2(1:G) SR4.6(QG)
COLNGATE10: COL10..2(1:G) SR5.15(QA)
COLNGATE11: COL11..2(1:G) SR5.2(QC)
COLNGATE12: COL12..2(1:G) SR5.4(QE)
COLNGATE13: COL13..2(1:G) SR5.6(QG)
COLNGATE14: COL14..2(1:G) SR6.15(QA)
COLNGATE15: COL15..2(1:G) SR6.2(QC)
COLNGATE16: COL16..2(1:G) SR6.4(QE)
COLNGATE17: COL17..2(1:G) SR6.6(QG)
COLNGATE18: COL18..2(1:G) SR7.15(QA)
COLNGATE19: COL19..2(1:G) SR7.2(QC)
COLNGATE20: COL20..2(1:G) SR7.4(QE)
COLNGATE21: COL21..2(1:G) SR7.6(QG)
COLNGATE22: COL22..2(1:G) SR8.15(QA)
COLNGATE23: COL23..2(1:G) SR8.2(QC)
COLNGATE24: COL24..2(1:G) SR8.4(QE)
COLNGATE25: COL25..2(1:G) SR8.6(QG)
COLNGATE26: COL26..2(1:G) SR9.15(QA)
COLNGATE27: COL27..2(1:G) SR9.2(QC)
COLNGATE28: COL28..2(1:G) SR9.4(QE)
COLNGATE29: COL29..2(1:G) SR9.6(QG)
COLNGATE30: COL30..2(1:G) SR10.15(QA)
COLNGATE31: COL31..2(1:G) SR10.2(QC)
COLNGATE32: COL32..2(1:G) SR10.4(QE)
COLNGATE33: COL33..2(1:G) SR10.6(QG)
COLNGATE34: COL34..2(1:G) SR11.15(QA)
COLNGATE35: COL35..2(1:G) SR11.2(QC)
COLNGATE36: COL36..2(1:G) SR11.4(QE)
COLNGATE37: COL37..2(1:G) SR11.6(QG)
COLNGATE38: COL38..2(1:G) SR12.15(QA)
COLNGATE39: COL39..2(1:G) SR12.2(QC)
COLNGATE40: COL40..2(1:G) SR12.4(QE)
COLNGATE41: COL41..2(1:G) SR12.6(QG)
COLNGATE42: COL42..2(1:G) SR13.15(QA)
COLNGATE43: COL43..2(1:G) SR13.2(QC)
COLNGATE44: COL44..2(1:G) SR13.4(QE)
COLNGATE45: COL45..2(1:G) SR13.6(QG)
COLPGATE1: COL1..4(2:G) SR2.7(QH)
COLPGATE2: COL2..4(2:G) SR3.1(QB)
COLPGATE3: COL3..4(2:G) SR3.3(QD)
COLPGATE4: COL4..4(2:G) SR3.5(QF)
COLPGATE5: COL5..4(2:G) SR3.7(QH)
COLPGATE6: COL6..4(2:G) SR4.1(QB)
COLPGATE7: COL7..4(2:G) SR4.3(QD)
COLPGATE8: COL8..4(2:G) SR4.5(QF)
COLPGATE9: COL9..4(2:G) SR4.7(QH)
COLPGATE10: COL10..4(2:G) SR5.1(QB)
COLPGATE11: COL11..4(2:G) SR5.3(QD)
COLPGATE12: COL12..4(2:G) SR5.5(QF)
COLPGATE13: COL13..4(2:G) SR5.7(QH)
COLPGATE14: COL14..4(2:G) SR6.1(QB)
COLPGATE15: COL15..4(2:G) SR6.3(QD)
COLPGATE16: COL16..4(2:G) SR6.5(QF)
COLPGATE17: COL17..4(2:G) SR6.7(QH)
COLPGATE18: COL18..4(2:G) SR7.1(QB)
COLPGATE19: COL19..4(2:G) SR7.3(QD)
COLPGATE20: COL20..4(2:G) SR7.5(QF)
COLPGATE21: COL21..4(2:G) SR7.7(QH)
COLPGATE22: COL22..4(2:G) SR8.1(QB)
COLPGATE23: COL23..4(2:G) SR8.3(QD)
COLPGATE24: COL24..4(2:G) SR8.5(QF)
COLPGATE25: COL25..4(2:G) SR8.7(QH)
COLPGATE26: COL26..4(2:G) SR9.1(QB)
COLPGATE27: COL27..4(2:G) SR9.3(QD)
COLPGATE28: COL28..4(2:G) SR9.5(QF)
COLPGATE29: COL29..4(2:G) SR9.7(QH)
COLPGATE30: COL30..4(2:G) SR10.1(QB)
COLPGATE31: COL31..4(2:G) SR10.3(QD)
COLPGATE32: COL32..4(2:G) SR10.5(QF)
COLPGATE33: COL33..4(2:G) SR10.7(QH)
COLPGATE34: COL34..4(2:G) SR11.1(QB)
COLPGATE35: COL35..4(2:G) SR11.3(QD)
COLPGATE36: COL36..4(2:G) SR11.5(QF)
COLPGATE37: COL37..4(2:G) SR11.7(QH)
COLPGATE38: COL38..4(2:G) SR12.1(QB)
COLPGATE39: COL39..4(2:G) SR12.3(QD)
COLPGATE40: COL40..4(2:G) SR12.5(QF)
COLPGATE41: COL41..4(2:G) SR12.7(QH)
COLPGATE42: COL42..4(2:G) SR13.1(QB)
COLPGATE43: COL43..4(2:G) SR13.3(QD)
COLPGATE44: COL44..4(2:G) SR13.5(QF)
COLPGATE45: COL45..4(2:G) SR13.7(QH)
FLIPVOLTPOSITIVE [flipvoltpositive]: COL1..3(2:S) COL2..3(2:S) COL3..3(2:S) COL4..3(2:S) COL5..3(2:S) COL6..3(2:S) COL7..3(2:S) COL8..3(2:S) COL9..3(2:S) COL10..3(2:S) COL11..3(2:S) COL12..3(2:S) COL13..3(2:S) COL14..3(2:S) COL15..3(2:S) COL16..3(2:S) COL17..3(2:S) COL18..3(2:S) COL19..3(2:S) COL20..3(2:S) COL21..3(2:S) COL22..3(2:S) COL23..3(2:S) COL24..3(2:S) COL25..3(2:S) COL26..3(2:S) COL27..3(2:S) COL28..3(2:S) COL29..3(2:S) COL30..3(2:S) COL31..3(2:S) COL32..3(2:S) COL33..3(2:S) COL34..3(2:S) COL35..3(2:S) COL36..3(2:S) COL37..3(2:S) COL38..3(2:S) COL39..3(2:S) COL40..3(2:S) COL41..3(2:S) COL42..3(2:S) COL43..3(2:S) COL44..3(2:S) COL45..3(2:S) FLIPCAP.+ JP1.3 R2.2 R4.2 R6.2 R8.2 R10.2 R12.2 R14.2 ROW1..3(2:S) ROW2..3(2:S) ROW3..3(2:S) ROW4..3(2:S) ROW5..3(2:S) ROW6..3(2:S) ROW7..3(2:S)
GND [gnd]: C1.2 C2.2 C3.2 C4.2 C5.2 C6.2 C7.2 C8.2 C9.2 C10.2 C11.2 C12.2 C13.2 COL1..1(1:S) COL2..1(1:S) COL3..1(1:S) COL4..1(1:S) COL5..1(1:S) COL6..1(1:S) COL7..1(1:S) COL8..1(1:S) COL9..1(1:S) COL10..1(1:S) COL11..1(1:S) COL12..1(1:S) COL13..1(1:S) COL14..1(1:S) COL15..1(1:S) COL16..1(1:S) COL17..1(1:S) COL18..1(1:S) COL19..1(1:S) COL20..1(1:S) COL21..1(1:S) COL22..1(1:S) COL23..1(1:S) COL24..1(1:S) COL25..1(1:S) COL26..1(1:S) COL27..1(1:S) COL28..1(1:S) COL29..1(1:S) COL30..1(1:S) COL31..1(1:S) COL32..1(1:S) COL33..1(1:S) COL34..1(1:S) COL35..1(1:S) COL36..1(1:S) COL37..1(1:S) COL38..1(1:S) COL39..1(1:S) COL40..1(1:S) COL41..1(1:S) COL42..1(1:S) COL43..1(1:S) COL44..1(1:S) COL45..1(1:S) FLIPCAP.- JP1.1 JP1.8 LOGICCAP.- R1.1 R3.1 R5.1 R7.1 R9.1 R11.1 R13.1 ROW1..1(1:S) ROW2..1(1:S) ROW3..1(1:S) ROW4..1(1:S) ROW5..1(1:S) ROW6..1(1:S) ROW7..1(1:S) SR1.13(G) SR2.13(G) SR3.13(G) SR4.13(G) SR5.13(G) SR6.13(G) SR7.13(G) SR8.13(G) SR9.13(G) SR10.13(G) SR11.13(G) SR12.13(G) SR13.13(G) X1.A1 X1.C1
LEDPOS [ledpos]: JP1.4 X1.A2 X1.C2
MAINSERIALLINE: JP1.7 SR1.14(SER)
RCK: JP1.5 SR1.12(RCK) SR2.12(RCK) SR3.12(RCK) SR4.12(RCK) SR5.12(RCK) SR6.12(RCK) SR7.12(RCK) SR8.12(RCK) SR9.12(RCK) SR10.12(RCK) SR11.12(RCK) SR12.12(RCK) SR13.12(RCK)
ROW1NCOM [fetcommons]: ROW1..7(1:D) ROW1..8(1:D) X1.C3
ROW1PCOM [fetcommons]: ROW1..5(2:D) ROW1..6(2:D) X1.A3
ROW2NCOM [fetcommons]: ROW2..7(1:D) ROW2..8(1:D) X1.C4
ROW2PCOM [fetcommons]: ROW2..5(2:D) ROW2..6(2:D) X1.A4
ROW3NCOM [fetcommons]: ROW3..7(1:D) ROW3..8(1:D) X1.C5
ROW3PCOM [fetcommons]: ROW3..5(2:D) ROW3..6(2:D) X1.A5
ROW4NCOM [fetcommons]: ROW4..7(1:D) ROW4..8(1:D) X1.C6
ROW4PCOM [fetcommons]: ROW4..5(2:D) ROW4..6(2:D) X1.A6
ROW5NCOM [fetcommons]: ROW5..7(1:D) ROW5..8(1:D) X1.C7
ROW5PCOM [fetcommons]: ROW5..5(2:D) ROW5..6(2:D) X1.A7
ROW6NCOM [fetcommons]: ROW6..7(1:D) ROW6..8(1:D) X1.C8
ROW6PCOM [fetcommons]: ROW6..5(2:D) ROW6..6(2:D) X1.A8
ROW7NCOM [fetcommons]: ROW7..7(1:D) ROW7..8(1:D) X1.C9
ROW7PCOM [fetcommons]: ROW7..5(2:D) ROW7..6(2:D) X1.A9
ROWNGATE1: R1.2 ROW1..2(1:G) SR1.15(QA)
ROWNGATE2: R3.2 ROW2..2(1:G) SR1.2(QC)
ROWNGATE3: R5.2 ROW3..2(1:G) SR1.4(QE)
ROWNGATE4: R7.2 ROW4..2(1:G) SR1.6(QG)
ROWNGATE5: R9.2 ROW5..2(1:G) SR2.15(QA)
ROWNGATE6: R11.2 ROW6..2(1:G) SR2.2(QC)
ROWNGATE7: R13.2 ROW7..2(1:G) SR2.4(QE)
ROWPGATE1: R2.1 ROW1..4(2:G) SR1.1(QB)
ROWPGATE2: R4.1 ROW2..4(2:G) SR1.3(QD)
ROWPGATE3: R6.1 ROW3..4(2:G) SR1.5(QF)
ROWPGATE4: R8.1 ROW4..4(2:G) SR1.7(QH)
ROWPGATE5: R10.1 ROW5..4(2:G) SR2.1(QB)
ROWPGATE6: R12.1 ROW6..4(2:G) SR2.3(QD)
ROWPGATE7: R14.1 ROW7..4(2:G) SR2.5(QF)
SCK: JP1.6 SR1.11(SCK) SR2.11(SCK) SR3.11(SCK) SR4.11(SCK) SR5.11(SCK) SR6.11(SCK) SR7.11(SCK) SR8.11(SCK) SR9.11(SCK) SR10.11(SCK) SR11.11(SCK) SR12.11(SCK) SR13.11(SCK)
SR1TOSR2: SR1.9(QH*) SR2.14(SER)
SR2TOSR3: SR2.9(QH*) SR3.14(SER)
SR3TOSR4: SR3.9(QH*) SR4.14(SER)
SR4TOSR5: SR4.9(QH*) SR5.14(SER)
SR5TOSR6: SR5.9(QH*) SR6.14(SER)
SR6TOSR7: SR6.9(QH*) SR7.14(SER)
SR7TOSR8: SR7.9(QH*) SR8.14(SER)
SR8TOSR9: SR8.9(QH*) SR9.14(SER)
SR9TOSR10: SR9.9(QH*) SR10.14(SER)
SR10TOSR11: SR10.9(QH*) SR11.14(SER)
SR11TOSR12: SR11.9(QH*) SR12.14(SER)
SR12TOSR13: SR12.9(QH*) SR13.14(SER)
VCC: C1.1 C2.1 C3.1 C4.1 C5.1 C6.1 C7.1 C8.1 C9.1 C10.1 C11.1 C12.1 C13.1 JP1.2 LOGICCAP.+ SR1.10(SCL) SR2.10(SCL) SR3.10(SCL) SR4.10(SCL) SR5.10(SCL) SR6.10(SCL) SR7.10(SCL) SR8.10(SCL) SR9.10(SCL) SR10.10(SCL) SR11.10(SCL) SR12.10(SCL) SR13.10(SCL)
Unconnected: SR13.9(QH*) X1.A10

## Buses
ROWNGATE[1..7],ROWPGATE[1..7],COLNGATE[1..45],COLPGATE[1..45]
SCK,RCK

## Notes on the sheet
- logic vcc
- For all PN MOSFETs (Rows and Cols)
  --------------------------------------------
  Lower numbered (name) resistor
  goes on lower section of ea group
  of PN MOSFETs.
  P is top MOS, N is bottom MOS.

## Power pins joined to a net without a drawn wire
GND: SR1.8(GND) SR2.8(GND) SR3.8(GND) SR4.8(GND) SR5.8(GND) SR6.8(GND) SR7.8(GND) SR8.8(GND) SR9.8(GND) SR10.8(GND) SR11.8(GND) SR12.8(GND) SR13.8(GND)
VCC: SR1.16(VCC) SR2.16(VCC) SR3.16(VCC) SR4.16(VCC) SR5.16(VCC) SR6.16(VCC) SR7.16(VCC) SR8.16(VCC) SR9.16(VCC) SR10.16(VCC) SR11.16(VCC) SR12.16(VCC) SR13.16(VCC)

## Library data of the parts
C1-C13 = rcl:C-US: CAPACITOR, American symbol
COL1. COL2. COL3. COL4. COL5. COL6. COL7. COL8. COL9. COL10. COL11. COL12. COL13. COL14. COL15. COL16. COL17. COL18. COL19. COL20. COL21. COL22. COL23. COL24. COL25. COL26. COL27. COL28. COL29. COL30. COL31. COL32. COL33. COL34. COL35. COL36. COL37. COL38. COL39. COL40. COL41. COL42. COL43. COL44. COL45. ROW1. ROW2. ROW3. ROW4. ROW5. ROW6. ROW7. = zetex:PN_MOSFET-: DUAL N AND P-CHANNEL ENHANCEMENT MODE MOSFET Source: Data sheet <http://www.farnell.com/datasheets/1693880.pdf>; OC_FARNELL: unknown; OC_NEWARK: unknown
FLIPCAP LOGICCAP = resistor:CPOL-US: POLARIZED CAPACITOR, American symbol
JP1 = pinhead:PINHD-1X8: PIN HEADER
R1-R14 = resistor:R-US_: RESISTOR, American symbol
SR1-SR13 = 74xx-us:74*595: 8-bit SHIFT REGISTER, output latch
X1 = con-vg:FAC64S: CONNECTOR female, 64 pins, block, type C, rows AC, grid 5.08 mm

## Net classes
0 default: width 0.254 mm, drill 0.305 mm, clearance 0.203 mm
1 flipvoltpositive: width 0.305 mm, drill 0.305 mm, clearance 0.203 mm
2 ledpos: width 0.762 mm, drill 0.305 mm, clearance 0.203 mm
3 gnd: width 0.406 mm, drill 0.305 mm, clearance 0.203 mm
4 fetcommons: width 0.305 mm, drill 0.305 mm, clearance 0.203 mm